# EAGLE design 4P-20700-Mod-PCB-BETA (EAGLE 9.5.2)
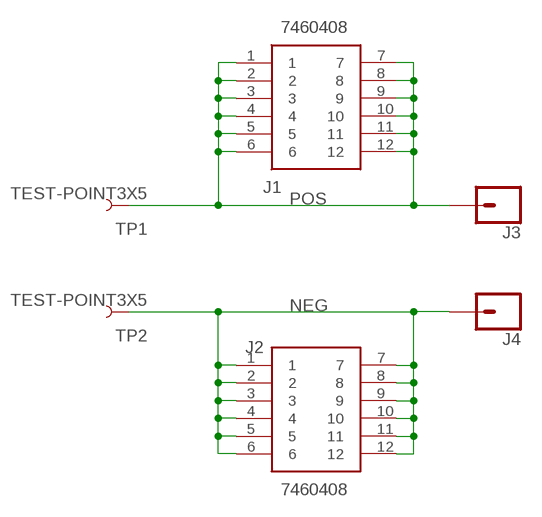
[diagram p0: schematic, sheet 1]

## Parts
J1  7460408  [7460408]
J2  7460408  [7460408]
J3  CONN_01  [1X01]
J4  CONN_01  [1X01]
TP1  TEST-POINT3X5  [PAD.03X.05]
TP2  TEST-POINT3X5  [PAD.03X.05]

## Nets
NEG: J2.1 J2.2 J2.3 J2.4 J2.5 J2.6 J2.7 J2.8 J2.9 J2.10 J2.11 J2.12 J4.1 TP2.P$1
POS: J1.1 J1.2 J1.3 J1.4 J1.5 J1.6 J1.7 J1.8 J1.9 J1.10 J1.11 J1.12 J3.1 TP1.P$1

## Library data of the parts
J1 J2 = SamacSys_Parts:7460408: Wurth Elektronik REDCUBE 12 Pin Power Element, 175A, Press Fit, M5, Vertical Source: Datasheet <https://componentsearchengine.com/Datasheets/1/7460408.pdf>; DESCRIPTION: Wurth Elektronik REDCUBE 12 Pin Power Element, 175A, Press Fit, M5, Vertical; HEIGHT: 6mm; MANUFACTURER_NAME: Wurth Elektronik; MANUFACTURER_PART_NUMBER: 7460408; MOUSER_PART_NUMBER: 710-7460408; MOUSER_PRICE-STOCK: https://www.mouser.com/Search/Refine.aspx?Keyword=710-7460408
J3 J4 = SparkFun-Connectors:CONN_01: Single connection point. Often used as Generic Header-pin footprint for 0.1 inch spaced/style header connections On any of the 0.1 inch spaced packages, you can populate with these: Break Away Headers - Straight <https://www.sparkfun.com/products/116> (PRT-00116) Break Away Male Headers - Right Angle <https://www.sparkfun.com/products/553> (PRT-00553) Female Headers <https://www.sparkfun.com/products/115> (PRT-00115) Break Away Headers - Machine Pin <https://www.sparkfun.com/products/117> (PRT-00117) Break Away Female Headers - Swiss Machine Pin <https://www.sparkfun.com/products/743> (PRT-00743) This device is also useful as a general connection point to wire up your design to another part of your project. Our various solder wires solder well into these plated through hole pads. Hook-Up Wire - Assortment (Stranded, 22 AWG) <https://www.sparkfun.com/products/11375> (PRT-11375) Hook-Up Wire - Assortment (Solid Core, 22 AWG) <https://www.sparkfun.com/products/11367> (PRT-11367) View the entire wire category on our website here <https://www.sparkfun.com/categories/141> Special notes: SMTSO-256-ET is a "flush mount" nut for a 4-40 screw. We mostly use this on specialty testbeds; it is a nice way to connect hardware to your PCB at an adjustable hieght. Also note, the SNAP packages are for using a snappable style connector. We sell a baggie of snaps and they are also used on two LilyPad designs: Snap Assortment - 30 pack (male and female) <https://www.sparkfun.com/products/11347> (DEV-11347) LilyPad Arduino SimpleSnap <https://www.sparkfun.com/products/10941> (DEV-10941) LilyPad SimpleSnap Protoboard <https://www.sparkfun.com/products/10940> (DEV-10940)
TP1 TP2 = SparkFun-Connectors:TEST-POINT: SparkFun Test Points Bare copper test points for troubleshooting or In-Circuit-Testing. These are used by our Production team for verifying production board runs using pogo-pins on test beds. SparkFun Products: SparkFun LSM9DS1 Breakout <https://www.sparkfun.com/products/13284> SparkFun PSOC <https://www.sparkfun.com/products/13714> SparkFun Load Cell Amplifier <https://www.sparkfun.com/products/13879>

## Board
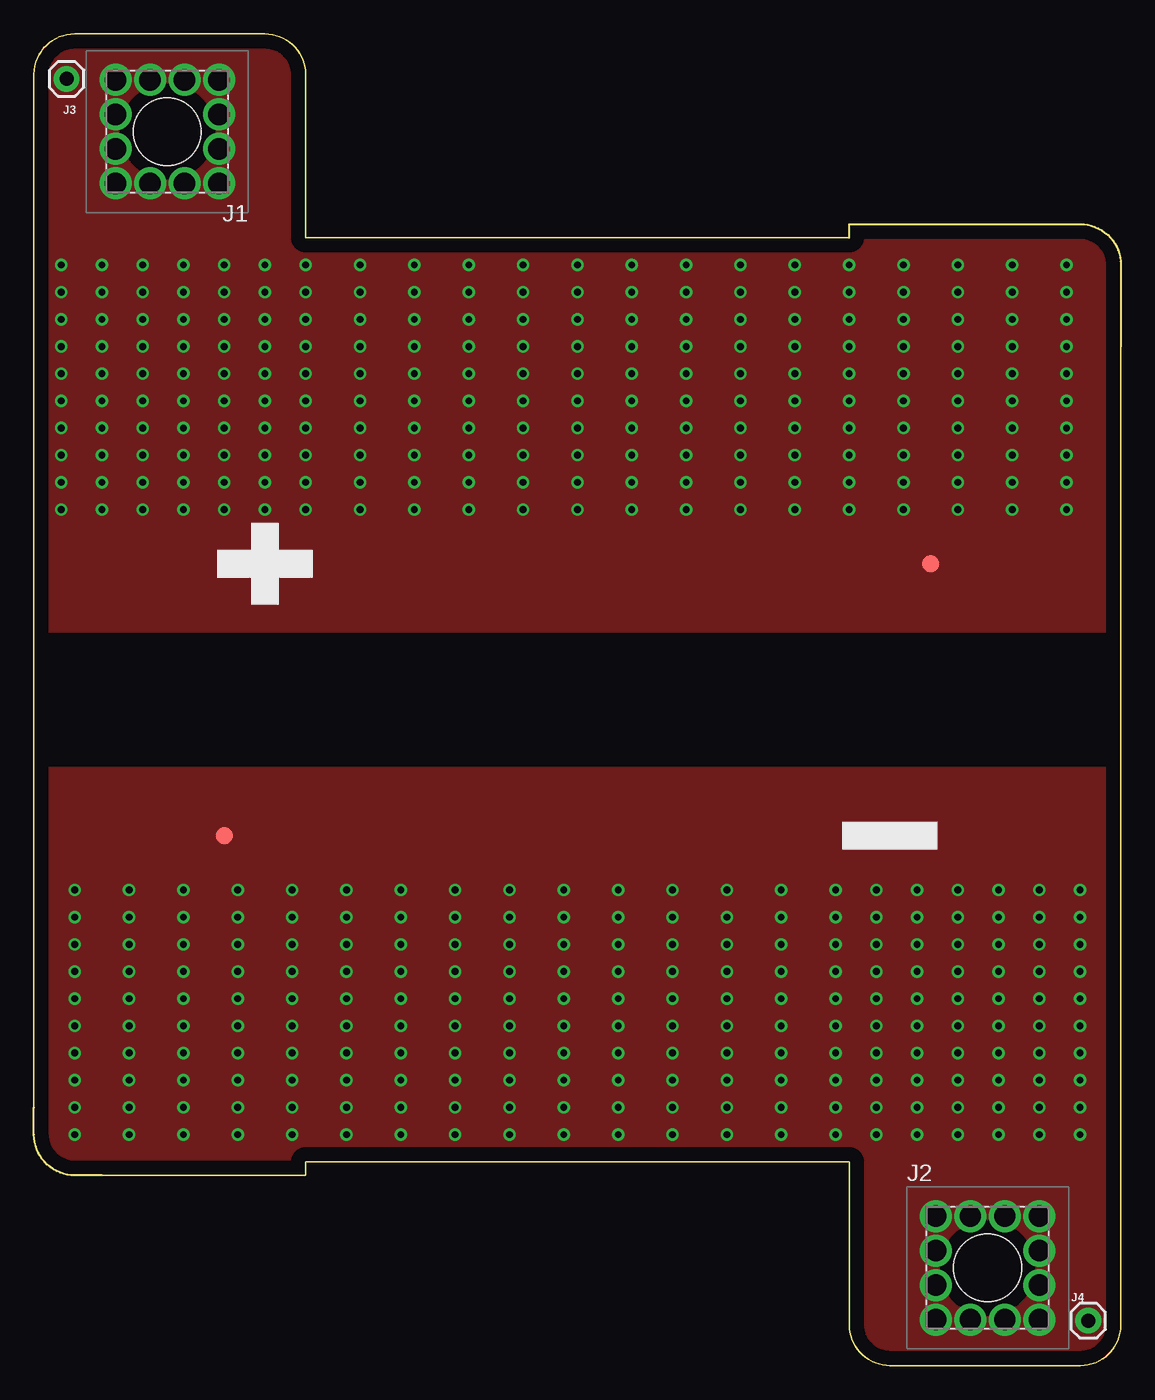
[diagram p1: board, top side]
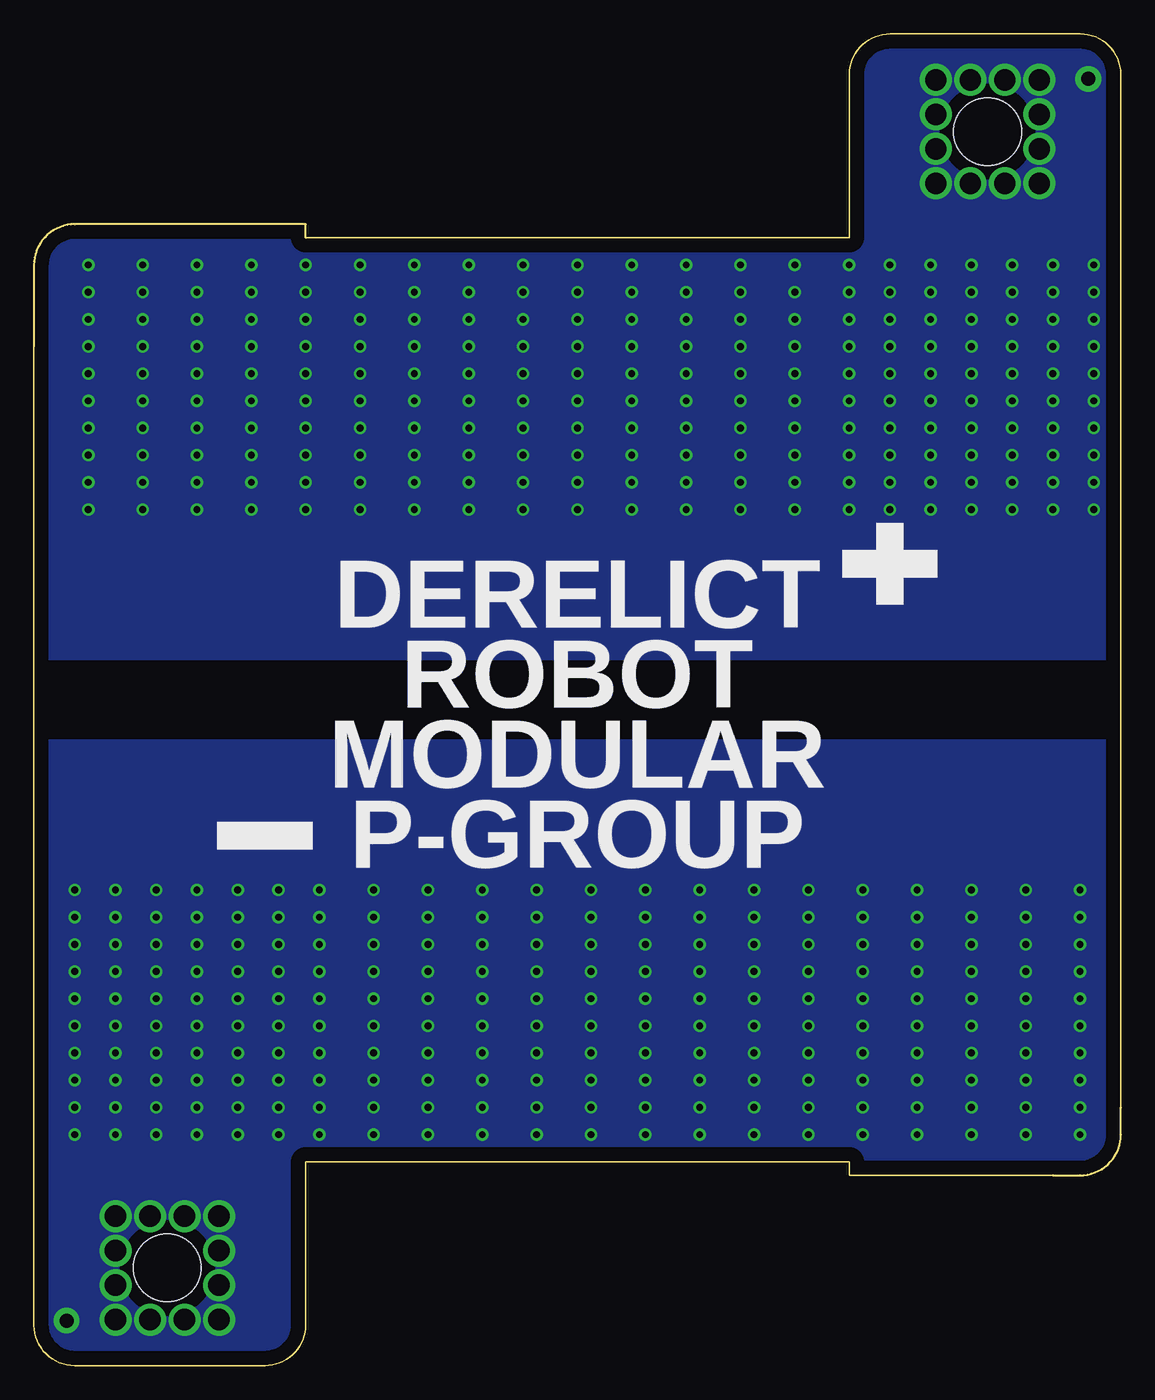
[diagram p2: board, bottom side, seen from below]

Size 80 x 98 mm. Coordinates in mm from the lower left corner, seen from the top.
Outline: 0,19 0,95.05 arc-90 3,98 17,98 arc-90 20,95 20,83 60,83 60,84 77,84 arc-90 80,81 80,75 80,2.95 arc-90 77,0 63,0 arc-90 60,3 60,15 20,15 20,14 5,14 3,14 arc-90 0,17 0,19
Copper layers (1*16): Top 0.035mm / dielectric 1.5mm / Bottom 0.035mm
Design rules "default": minimum track width 6mil, minimum drill 0.35mm, track to track 6mil, track to pad 6mil, pad to pad 6mil, via to via 6mil, smd to smd 6mil, copper to edge 40mil, drill to drill 6mil, minimum pad ring 10mil, minimum via ring 8mil, stop-mask expansion 4mil, vias tented up to drill 0mil, thermal gap 10mil

### Footprints (pad centres in the part's own frame; a part is rotated, then mirrored left to right if it is on the bottom)
7460408 = drill 1.57 pad 2.3: 1 0,0; 2 2.54,0; 3 5.08,0; 4 7.62,0; 5 7.62,2.54; 6 7.62,5.08; 7 7.62,7.62; 8 5.08,7.62; 9 2.54,7.62; 10 0,7.62; 11 0,5.08; 12 0,2.54 | hole 5: 3.81,3.81
1X01 = drill 1.016 pad 1.88: 1 0,0
PAD.03X.05 = smd 1.27 x 1.27: P$1 0,0

### Placement (x,y rotation side)
J1  6,87 0 top
J2  74,11 180 top
J3  2.4,94.7 0 top
J4  77.6,3.3 0 top
TP1  66,59 180 top
TP2  14,39 0 top

### Tracks (layer width: path | path; a pad name or v marks a point on that pad's centre or on a via)
NEG  (via drill 0.5)
  other vias: 3,17 3,19 3,21 3,23 3,25 3,27 3,29 3,31 3,33 3,35 7,17 7,19 7,21 7,23 7,25 7,27 7,29 7,31 7,33 7,35 11,17 11,19 11,21 11,23 11,25 11,27 11,29 11,31 11,33 11,35 15,17 15,19 15,21 15,23 15,25 15,27 15,29 15,31 15,33 15,35 19,17 19,19 19,21 19,23 19,25 19,27 19,29 19,31 19,33 19,35 23,17 23,19 23,21 23,23 23,25 23,27 23,29 23,31 23,33 23,35 27,17 27,19 27,21 27,23 27,25 27,27 27,29 27,31 27,33 27,35 31,17 31,19 31,21 31,23 31,25 31,27 31,29 31,31 31,33 31,35 35,17 35,19 35,21 35,23 35,25 35,27 35,29 35,31 35,33 35,35 39,17 39,19 39,21 39,23 39,25 39,27 39,29 39,31 39,33 39,35 43,17 43,19 43,21 43,23 43,25 43,27 43,29 43,31 43,33 43,35 47,17 47,19 47,21 47,23 47,25 47,27 47,29 47,31 47,33 47,35 51,17 51,19 51,21 51,23 51,25 51,27 51,29 51,31 51,33 51,35 55,17 55,19 55,21 55,23 55,25 55,27 55,29 55,31 55,33 55,35 59,17 59,19 59,21 59,23 59,25 59,27 59,29 59,31 59,33 59,35 62,17 62,19 62,21 62,23 62,25 62,27 62,29 62,31 62,33 62,35 65,17 65,19 65,21 65,23 65,25 65,27 65,29 65,31 65,33 65,35 68,17 68,19 68,21 68,23 68,25 68,27 68,29 68,31 68,33 68,35 71,17 71,19 71,21 71,23 71,25 71,27 71,29 71,31 71,33 71,35 74,17 74,19 74,21 74,23 74,25 74,27 74,29 74,31 74,33 74,35 77,17 77,19 77,21 77,23 77,25 77,27 77,29 77,31 77,33 77,35
  pour Top (no thermals): -1,44 81,44 81,-2 -1,-2
  pour Bottom (no thermals): 0,46 81,46 81,-2 0,-2
POS  (via drill 0.5)
  other vias: 2,81 2,79 2,77 2,75 2,73 2,71 2,69 2,67 2,65 2,63 5,81 5,79 5,77 5,75 5,73 5,71 5,69 5,67 5,65 5,63 8,81 8,79 8,77 8,75 8,73 8,71 8,69 8,67 8,65 8,63 11,81 11,79 11,77 11,75 11,73 11,71 11,69 11,67 11,65 11,63 14,81 14,79 14,77 14,75 14,73 14,71 14,69 14,67 14,65 14,63 17,81 17,79 17,77 17,75 17,73 17,71 17,69 17,67 17,65 17,63 20,81 20,79 20,77 20,75 20,73 20,71 20,69 20,67 20,65 20,63 24,81 24,79 24,77 24,75 24,73 24,71 24,69 24,67 24,65 24,63 28,81 28,79 28,77 28,75 28,73 28,71 28,69 28,67 28,65 28,63 32,81 32,79 32,77 32,75 32,73 32,71 32,69 32,67 32,65 32,63 36,81 36,79 36,77 36,75 36,73 36,71 36,69 36,67 36,65 36,63 40,81 40,79 40,77 40,75 40,73 40,71 40,69 40,67 40,65 40,63 44,81 44,79 44,77 44,75 44,73 44,71 44,69 44,67 44,65 44,63 48,81 48,79 48,77 48,75 48,73 48,71 48,69 48,67 48,65 48,63 52,81 52,79 52,77 52,75 52,73 52,71 52,69 52,67 52,65 52,63 56,81 56,79 56,77 56,75 56,73 56,71 56,69 56,67 56,65 56,63 60,81 60,79 60,77 60,75 60,73 60,71 60,69 60,67 60,65 60,63 64,81 64,79 64,77 64,75 64,73 64,71 64,69 64,67 64,65 64,63 76,81 76,79 76,77 76,75 76,73 76,71 76,69 76,67 76,65 76,63 72,81 72,79 72,77 72,75 72,73 72,71 72,69 72,67 72,65 72,63 68,81 68,79 68,77 68,75 68,73 68,71 68,69 68,67 68,65 68,63
  pour Top (no thermals): 80,54 80,96 arc90 77,99 2,99 arc90 0,97 0,54
  pour Bottom (no thermals): -2,99 81,99 81,52 -2,52

### Text on the board
bPlace: DERELICT / ROBOT / MODULAR / P-GROUP